# EAGLE schematic LEDdriverSFE (EAGLE 6.2)
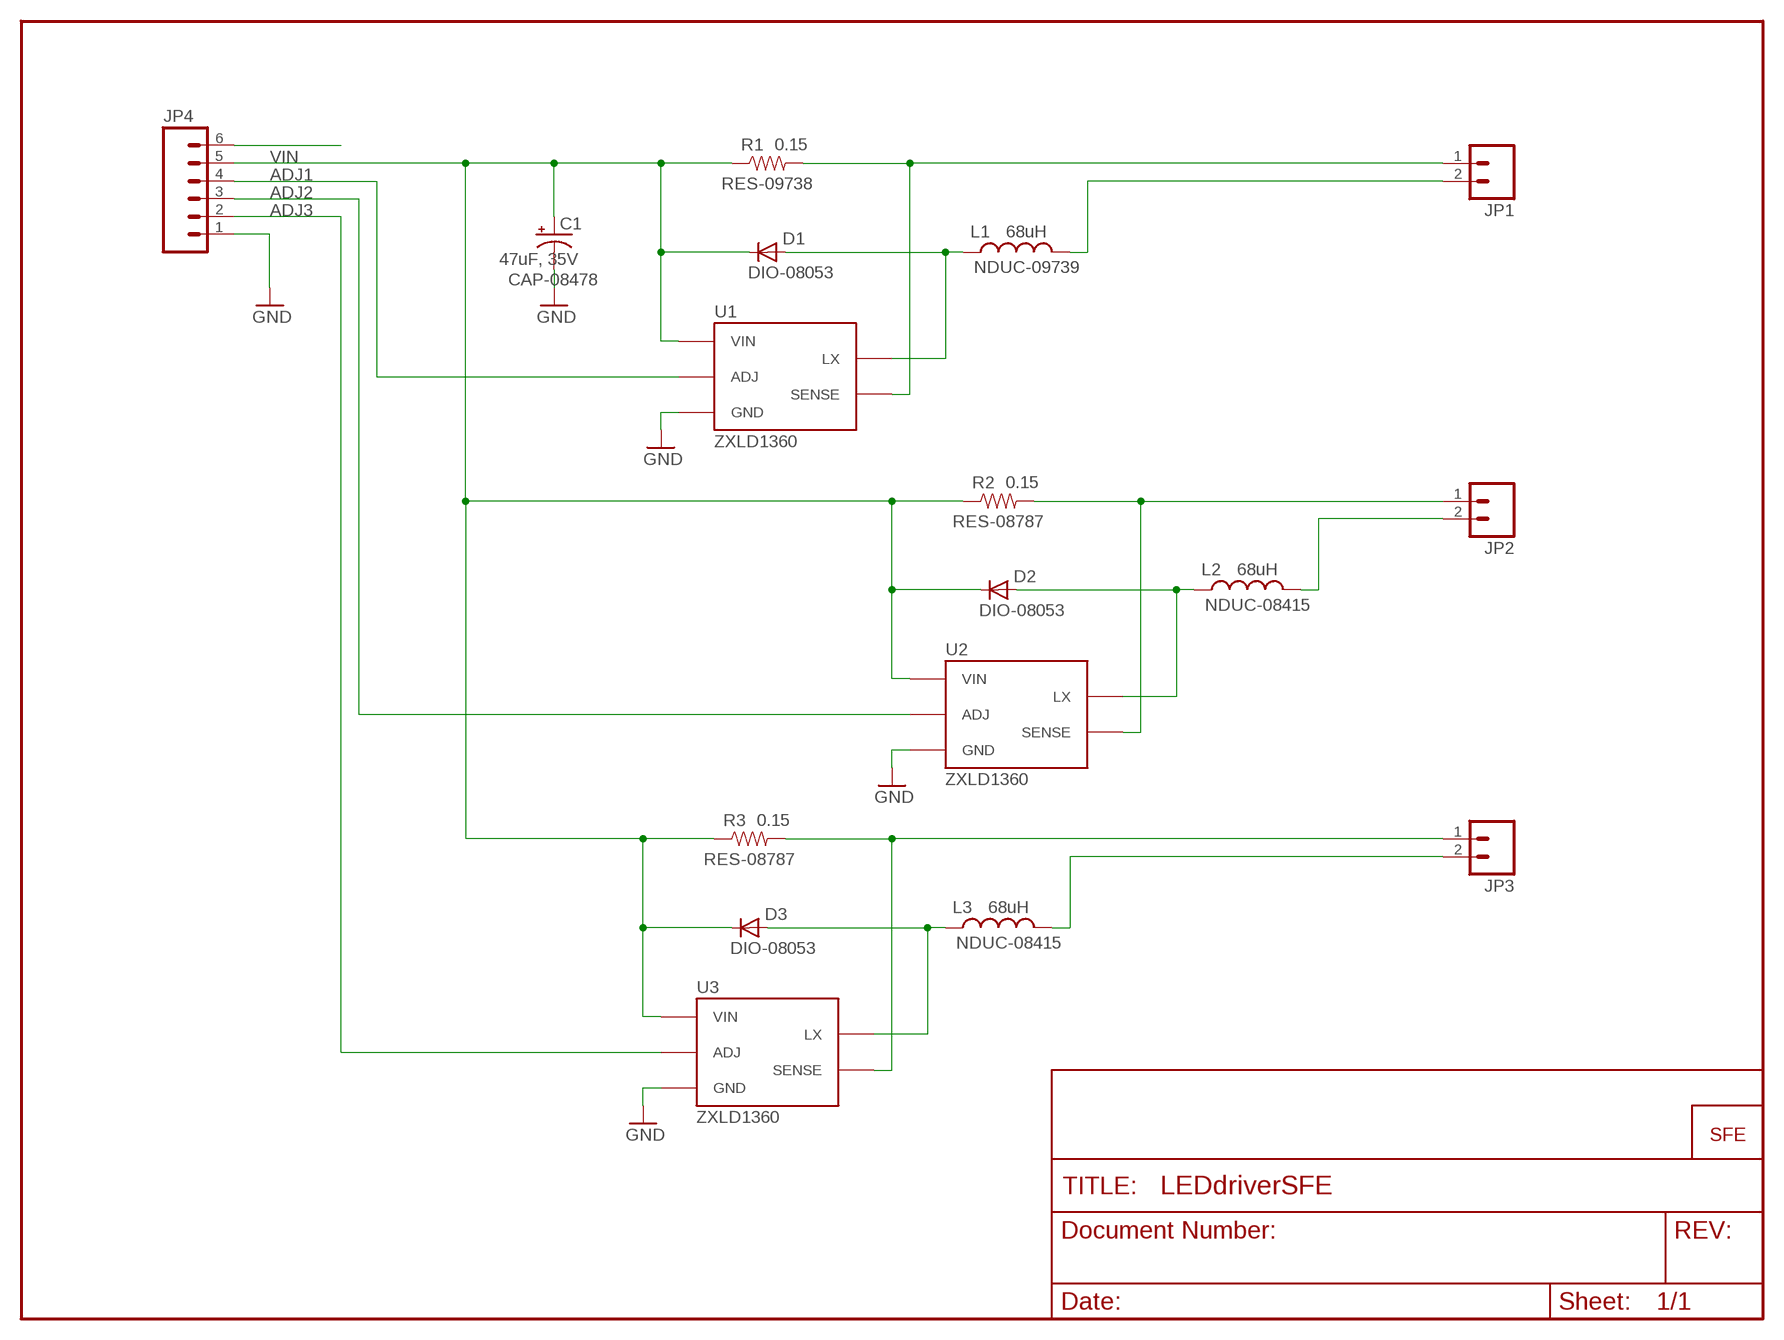
[diagram p0: schematic, sheet 1]

## Parts
C1  47uF, 35V  CAP_POLD  [PANASONIC_D]
D1  MBRA140  DIODESMA  [SMA-DIODE]
D2  MBRA140  DIODESMA  [SMA-DIODE]
D3  MBRA140  DIODESMA  [SMA-DIODE]
JP1  M02  [1X02_LONGPADS]
JP2  M02  [1X02_LONGPADS]
JP3  M02  [1X02_LONGPADS]
JP4  M06SIP  [1X06]
JP5  LOGO-SFENEW  [SFE-NEW-WEBLOGO]
L1  68uH  INDUCTORCR75  [CR75]
L2  68uH  INDUCTORCR75  [CR75]
L3  68uH  INDUCTORCR75  [CR75]
R1  0.15  RESISTOR0603-RES  [0603-RES]
R2  0.15  RESISTOR0603-RES  [0603-RES]
R3  0.15  RESISTOR0603-RES  [0603-RES]
U1  ZXLD1360  [SOT23-5]
U2  ZXLD1360  [SOT23-5]
U3  ZXLD1360  [SOT23-5]

## Nets
ADJ1: JP4.4 U1.3(ADJ)
ADJ2: JP4.3 U2.3(ADJ)
ADJ3: JP4.2 U3.3(ADJ)
GND: C1.- JP4.1 U1.2(GND) U2.2(GND) U3.2(GND)
N$1: JP1.2 L1.P$2
N$2: D2.A L2.P$1 U2.1(LX)
N$3: JP2.1 R2.2 U2.4(SENSE)
N$4: D1.A L1.P$1 U1.1(LX)
N$5: JP1.1 R1.2 U1.4(SENSE)
N$6: JP2.2 L2.P$2
N$7: D3.A L3.P$1 U3.1(LX)
N$8: JP3.1 R3.2 U3.4(SENSE)
N$9: JP3.2 L3.P$2
N$10: JP4.6
VIN: C1.+ D1.C D2.C D3.C JP4.5 R1.1 R2.1 R3.1 U1.5(VIN) U2.5(VIN) U3.5(VIN)

## Notes on the sheet
- RES-09738
- DIO-08053
- NDUC-09739
- CAP-08478
- RES-08787
- DIO-08053
- NDUC-08415
- RES-08787
- DIO-08053
- NDUC-08415

## Library data of the parts
C1 = SparkFun:CAP_POL: Capacitor Polarized These are standard SMD and PTH capacitors. Normally 10uF, 47uF, and 100uF in electrolytic and tantalum varieties. Always verify the external diameter of the through hole cap, it varies with capacity, voltage, and manufacturer. The EIA devices should be standard.
D1-D3 = SparkFun:DIODE: Diode These are standard reverse protection diodes and small signal diodes. SMA package can handle up to about 1A. SOD-323 can handle about 200mA. What the SOD-323 package when ordering, there are some mfgs out there that are 5-pin packages.
JP1-JP3 = SparkFun:M02: Header 2 Standard 2-pin 0.1" header. Use with straight break away headers (SKU : PRT-00116), right angle break away headers (PRT-00553), swiss pins (PRT-00743), machine pins (PRT-00117), and female headers (PRT-00115). Molex polarized connector foot print use with SKU : PRT-08233 with associated crimp pins and housings.
JP4 = SparkFun-Connectors:M06: Header 6 Standard 6-pin 0.1" header. Use with straight break away headers (SKU : PRT-00116), right angle break away headers (PRT-00553), swiss pins (PRT-00743), machine pins (PRT-00117), and female headers (PRT-00115). Molex polarized connector foot print use with SKU : PRT-08094 with associated crimp pins and housings. NOTES ON THE VARIANTS LOCK and LOCK_LONGPADS... This footprint was designed to help hold the alignment of a through-hole component (i.e. 6-pin header) while soldering it into place. You may notice that each hole has been shifted either up or down by 0.005 of an inch from it's more standard position (which is a perfectly straight line). This slight alteration caused the pins (the squares in the middle) to touch the edges of the holes. Because they are alternating, it causes a "brace" to hold the component in place. 0.005 has proven to be the perfect amount of "off-center" position when using our standard breakaway headers. Although looks a little odd when you look at the bare footprint, once you have a header in there, the alteration is very hard to notice. Also, if you push a header all the way into place, it is covered up entirely on the bottom side. This idea of altering the position of holes to aid alignment will be further integrated into the Sparkfun Library for other footprints. It can help hold any component with 3 or more connection pins.
JP5 = SparkFun:LOGO-SFE: Spark Fun Electronics PCB Logo This is the standard Spark Fun Electronics PCB logo.
L1-L3 = SparkFun:INDUCTOR: Inductors Basic Inductor/Choke - 0603 and 1206. Footprints are not proven and vary greatly between part numbers.
R1-R3 = SparkFun:RESISTOR: Resistor Basic schematic elements and footprints for 0603, 1206, and PTH 1/10th watt (small) resistors.
U1-U3 = SparkFun:ZXLD1360: Adjustable constant current switching driver for high-power LEDs